# EAGLE design main_full_64 (EAGLE 9.4.2)
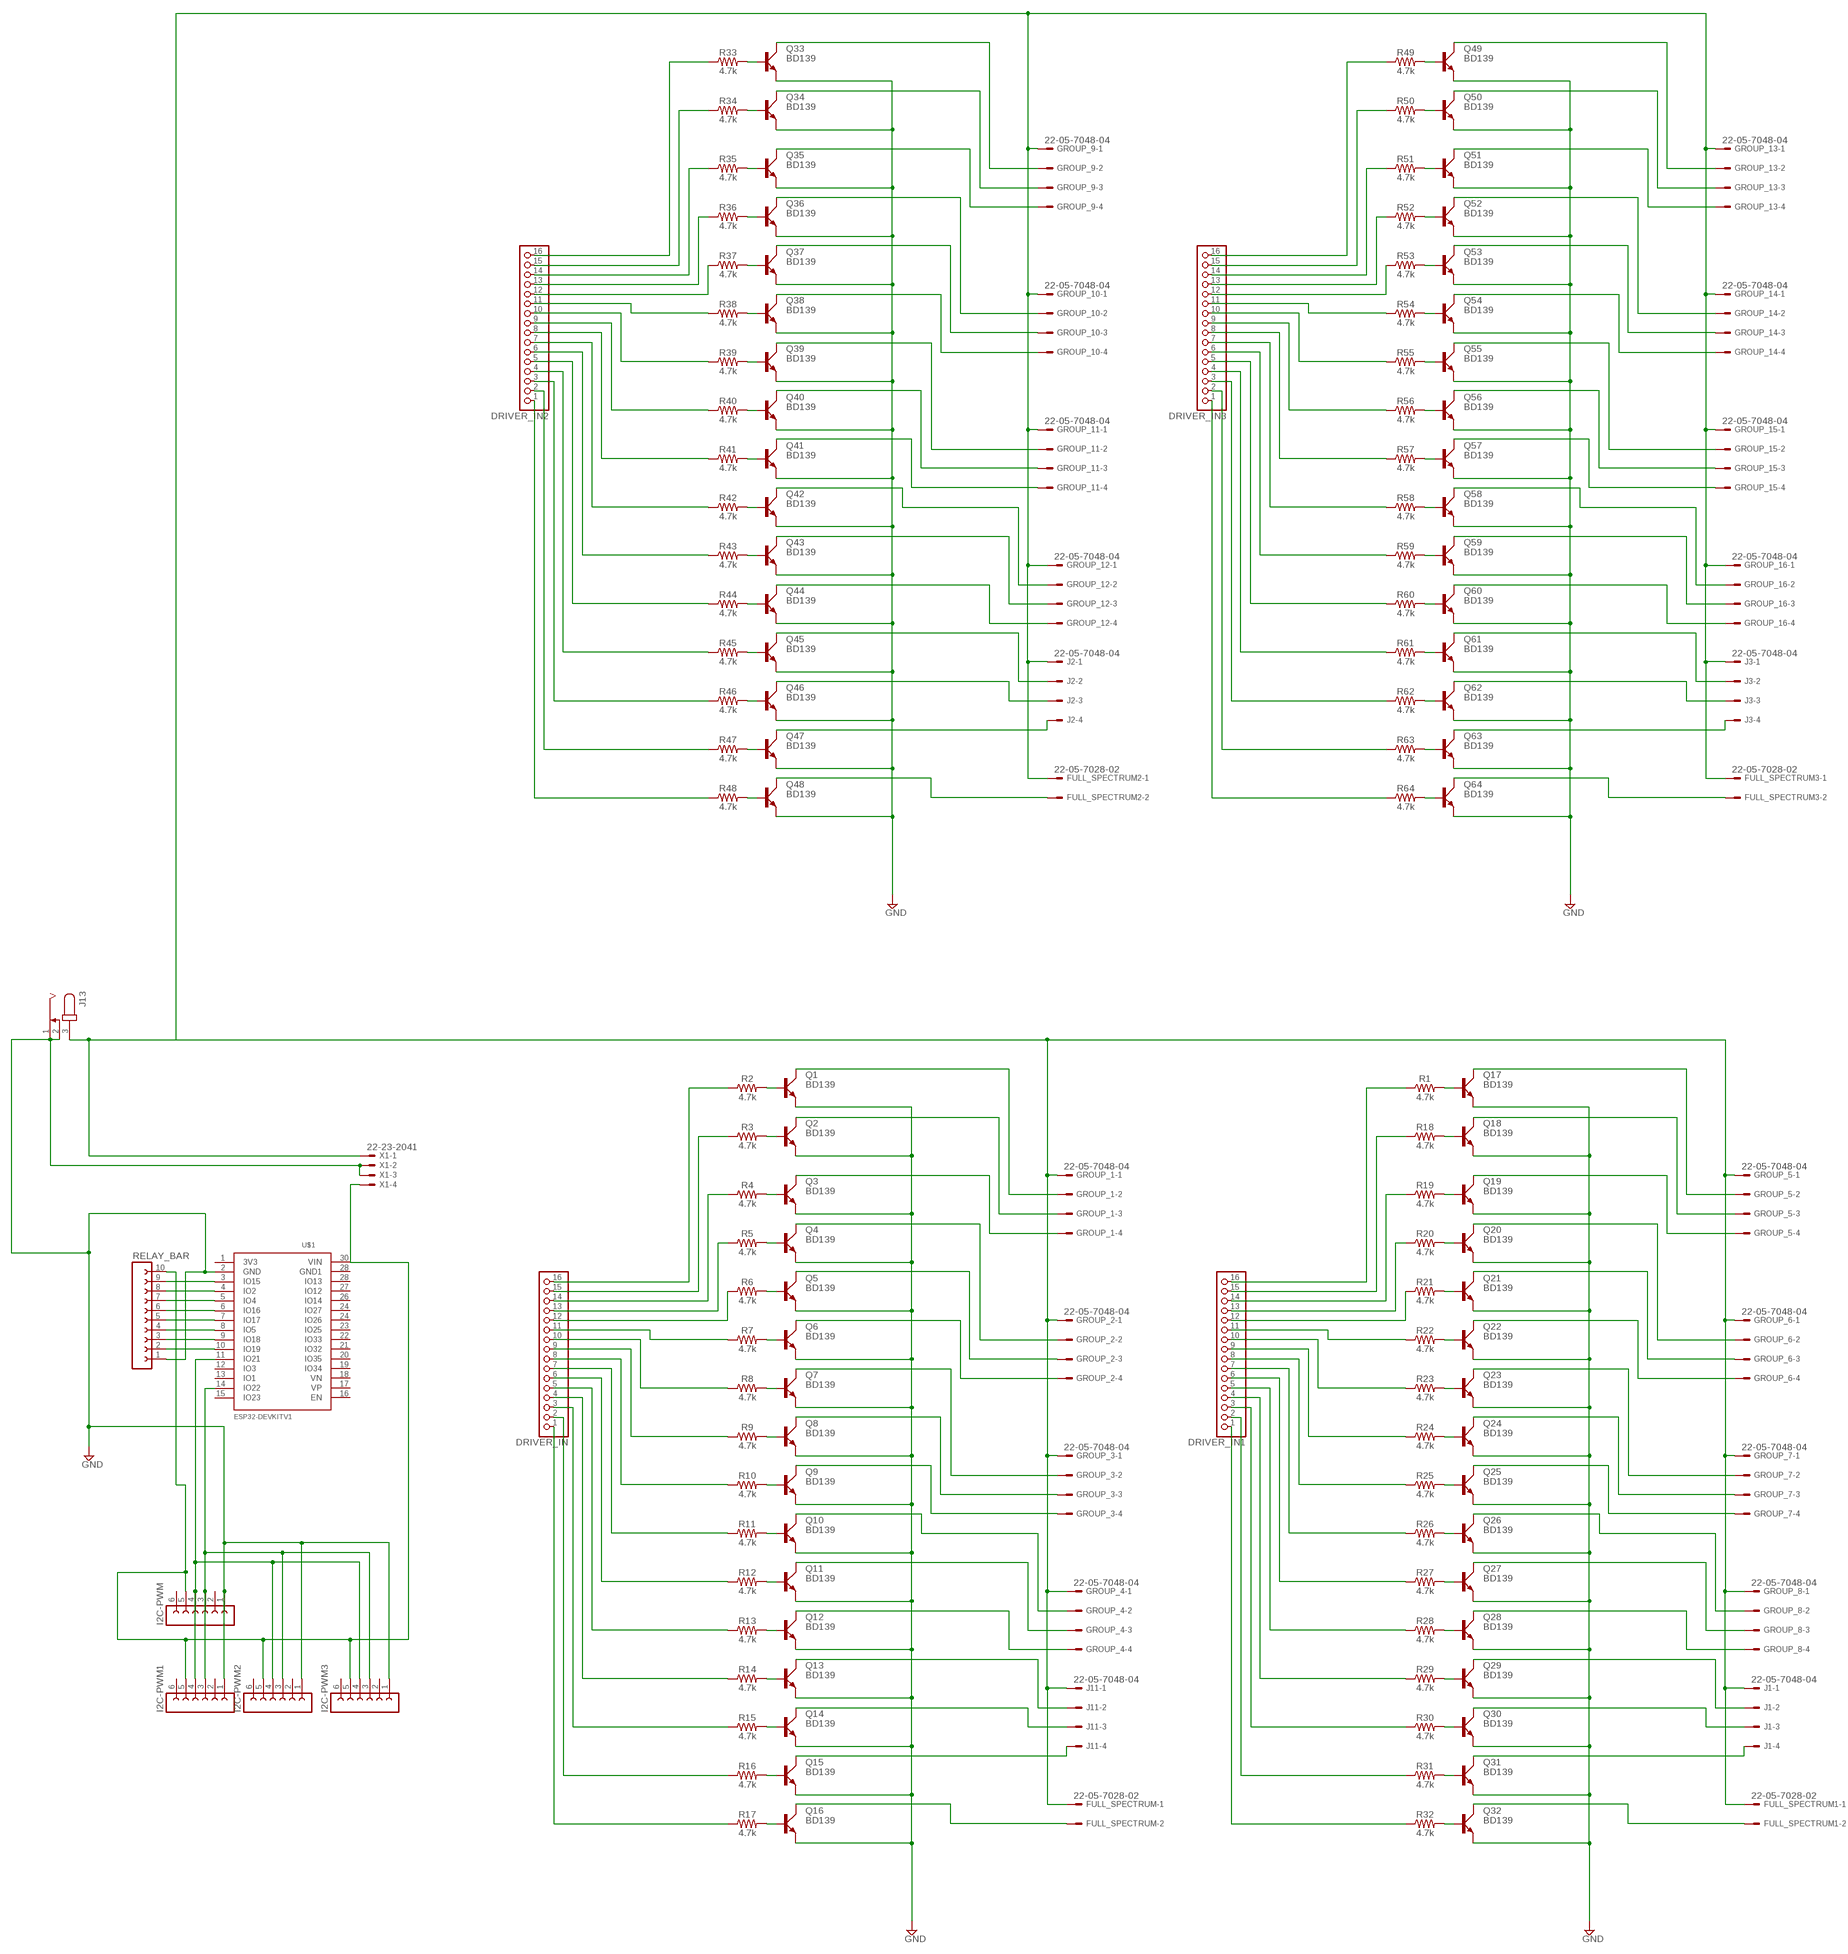
[diagram p0: schematic, sheet 1]

## Parts
DRIVER_IN  PINHD-1X16/90  [1X16/90]
DRIVER_IN1  PINHD-1X16/90  [1X16/90]
DRIVER_IN2  PINHD-1X16/90  [1X16/90]
DRIVER_IN3  PINHD-1X16/90  [1X16/90]
FULL_SPECTRUM  22-05-7028-02  [7395-02]
FULL_SPECTRUM1  22-05-7028-02  [7395-02]
FULL_SPECTRUM2  22-05-7028-02  [7395-02]
FULL_SPECTRUM3  22-05-7028-02  [7395-02]
GROUP_1  22-05-7048-04  [7395-04]
GROUP_2  22-05-7048-04  [7395-04]
GROUP_3  22-05-7048-04  [7395-04]
GROUP_4  22-05-7048-04  [7395-04]
GROUP_5  22-05-7048-04  [7395-04]
GROUP_6  22-05-7048-04  [7395-04]
GROUP_7  22-05-7048-04  [7395-04]
GROUP_8  22-05-7048-04  [7395-04]
GROUP_9  22-05-7048-04  [7395-04]
GROUP_10  22-05-7048-04  [7395-04]
GROUP_11  22-05-7048-04  [7395-04]
GROUP_12  22-05-7048-04  [7395-04]
GROUP_13  22-05-7048-04  [7395-04]
GROUP_14  22-05-7048-04  [7395-04]
GROUP_15  22-05-7048-04  [7395-04]
GROUP_16  22-05-7048-04  [7395-04]
I2C-PWM  FE06W  [FE06W]
I2C-PWM1  FE06W  [FE06W]
I2C-PWM2  FE06W  [FE06W]
I2C-PWM3  FE06W  [FE06W]
J1  22-05-7048-04  [7395-04]
J2  22-05-7048-04  [7395-04]
J3  22-05-7048-04  [7395-04]
J11  22-05-7048-04  [7395-04]
J13  JACK-PLUG0  [SPC4077]
Q1  BD139  [TO126AV]
Q2  BD139  [TO126AV]
Q3  BD139  [TO126AV]
Q4  BD139  [TO126AV]
Q5  BD139  [TO126AV]
Q6  BD139  [TO126AV]
Q7  BD139  [TO126AV]
Q8  BD139  [TO126AV]
Q9  BD139  [TO126AV]
Q10  BD139  [TO126AV]
Q11  BD139  [TO126AV]
Q12  BD139  [TO126AV]
Q13  BD139  [TO126AV]
Q14  BD139  [TO126AV]
Q15  BD139  [TO126AV]
Q16  BD139  [TO126AV]
Q17  BD139  [TO126AV]
Q18  BD139  [TO126AV]
Q19  BD139  [TO126AV]
Q20  BD139  [TO126AV]
Q21  BD139  [TO126AV]
Q22  BD139  [TO126AV]
Q23  BD139  [TO126AV]
Q24  BD139  [TO126AV]
Q25  BD139  [TO126AV]
Q26  BD139  [TO126AV]
Q27  BD139  [TO126AV]
Q28  BD139  [TO126AV]
Q29  BD139  [TO126AV]
Q30  BD139  [TO126AV]
Q31  BD139  [TO126AV]
Q32  BD139  [TO126AV]
Q33  BD139  [TO126AV]
Q34  BD139  [TO126AV]
Q35  BD139  [TO126AV]
Q36  BD139  [TO126AV]
Q37  BD139  [TO126AV]
Q38  BD139  [TO126AV]
Q39  BD139  [TO126AV]
Q40  BD139  [TO126AV]
Q41  BD139  [TO126AV]
Q42  BD139  [TO126AV]
Q43  BD139  [TO126AV]
Q44  BD139  [TO126AV]
Q45  BD139  [TO126AV]
Q46  BD139  [TO126AV]
Q47  BD139  [TO126AV]
Q48  BD139  [TO126AV]
Q49  BD139  [TO126AV]
Q50  BD139  [TO126AV]
Q51  BD139  [TO126AV]
Q52  BD139  [TO126AV]
Q53  BD139  [TO126AV]
Q54  BD139  [TO126AV]
Q55  BD139  [TO126AV]
Q56  BD139  [TO126AV]
Q57  BD139  [TO126AV]
Q58  BD139  [TO126AV]
Q59  BD139  [TO126AV]
Q60  BD139  [TO126AV]
Q61  BD139  [TO126AV]
Q62  BD139  [TO126AV]
Q63  BD139  [TO126AV]
Q64  BD139  [TO126AV]
R1  4.7k  4.7KOHM-0603-1/10W-1%  [0603]
R2  4.7k  4.7KOHM-0603-1/10W-1%  [0603]
R3  4.7k  4.7KOHM-0603-1/10W-1%  [0603]
R4  4.7k  4.7KOHM-0603-1/10W-1%  [0603]
R5  4.7k  4.7KOHM-0603-1/10W-1%  [0603]
R6  4.7k  4.7KOHM-0603-1/10W-1%  [0603]
R7  4.7k  4.7KOHM-0603-1/10W-1%  [0603]
R8  4.7k  4.7KOHM-0603-1/10W-1%  [0603]
R9  4.7k  4.7KOHM-0603-1/10W-1%  [0603]
R10  4.7k  4.7KOHM-0603-1/10W-1%  [0603]
R11  4.7k  4.7KOHM-0603-1/10W-1%  [0603]
R12  4.7k  4.7KOHM-0603-1/10W-1%  [0603]
R13  4.7k  4.7KOHM-0603-1/10W-1%  [0603]
R14  4.7k  4.7KOHM-0603-1/10W-1%  [0603]
R15  4.7k  4.7KOHM-0603-1/10W-1%  [0603]
R16  4.7k  4.7KOHM-0603-1/10W-1%  [0603]
R17  4.7k  4.7KOHM-0603-1/10W-1%  [0603]
R18  4.7k  4.7KOHM-0603-1/10W-1%  [0603]
R19  4.7k  4.7KOHM-0603-1/10W-1%  [0603]
R20  4.7k  4.7KOHM-0603-1/10W-1%  [0603]
R21  4.7k  4.7KOHM-0603-1/10W-1%  [0603]
R22  4.7k  4.7KOHM-0603-1/10W-1%  [0603]
R23  4.7k  4.7KOHM-0603-1/10W-1%  [0603]
R24  4.7k  4.7KOHM-0603-1/10W-1%  [0603]
R25  4.7k  4.7KOHM-0603-1/10W-1%  [0603]
R26  4.7k  4.7KOHM-0603-1/10W-1%  [0603]
R27  4.7k  4.7KOHM-0603-1/10W-1%  [0603]
R28  4.7k  4.7KOHM-0603-1/10W-1%  [0603]
R29  4.7k  4.7KOHM-0603-1/10W-1%  [0603]
R30  4.7k  4.7KOHM-0603-1/10W-1%  [0603]
R31  4.7k  4.7KOHM-0603-1/10W-1%  [0603]
R32  4.7k  4.7KOHM-0603-1/10W-1%  [0603]
R33  4.7k  4.7KOHM-0603-1/10W-1%  [0603]
R34  4.7k  4.7KOHM-0603-1/10W-1%  [0603]
R35  4.7k  4.7KOHM-0603-1/10W-1%  [0603]
R36  4.7k  4.7KOHM-0603-1/10W-1%  [0603]
R37  4.7k  4.7KOHM-0603-1/10W-1%  [0603]
R38  4.7k  4.7KOHM-0603-1/10W-1%  [0603]
R39  4.7k  4.7KOHM-0603-1/10W-1%  [0603]
R40  4.7k  4.7KOHM-0603-1/10W-1%  [0603]
R41  4.7k  4.7KOHM-0603-1/10W-1%  [0603]
R42  4.7k  4.7KOHM-0603-1/10W-1%  [0603]
R43  4.7k  4.7KOHM-0603-1/10W-1%  [0603]
R44  4.7k  4.7KOHM-0603-1/10W-1%  [0603]
R45  4.7k  4.7KOHM-0603-1/10W-1%  [0603]
R46  4.7k  4.7KOHM-0603-1/10W-1%  [0603]
R47  4.7k  4.7KOHM-0603-1/10W-1%  [0603]
R48  4.7k  4.7KOHM-0603-1/10W-1%  [0603]
R49  4.7k  4.7KOHM-0603-1/10W-1%  [0603]
R50  4.7k  4.7KOHM-0603-1/10W-1%  [0603]
R51  4.7k  4.7KOHM-0603-1/10W-1%  [0603]
R52  4.7k  4.7KOHM-0603-1/10W-1%  [0603]
R53  4.7k  4.7KOHM-0603-1/10W-1%  [0603]
R54  4.7k  4.7KOHM-0603-1/10W-1%  [0603]
R55  4.7k  4.7KOHM-0603-1/10W-1%  [0603]
R56  4.7k  4.7KOHM-0603-1/10W-1%  [0603]
R57  4.7k  4.7KOHM-0603-1/10W-1%  [0603]
R58  4.7k  4.7KOHM-0603-1/10W-1%  [0603]
R59  4.7k  4.7KOHM-0603-1/10W-1%  [0603]
R60  4.7k  4.7KOHM-0603-1/10W-1%  [0603]
R61  4.7k  4.7KOHM-0603-1/10W-1%  [0603]
R62  4.7k  4.7KOHM-0603-1/10W-1%  [0603]
R63  4.7k  4.7KOHM-0603-1/10W-1%  [0603]
R64  4.7k  4.7KOHM-0603-1/10W-1%  [0603]
RELAY_BAR  FE10W  [FE10W]
U$1  ESP32DEVKITV1  [ESP32-DEVKITV1]
X1  22-23-2041  [22-23-2041]

## Nets
GND: I2C-PWM1.1 I2C-PWM2.1 I2C-PWM3.1 I2C-PWM.1 J13.1 J13.2 Q1.E Q2.E Q3.E Q4.E Q5.E Q6.E Q7.E Q8.E Q9.E Q10.E Q11.E Q12.E Q13.E Q14.E Q15.E Q16.E Q17.E Q18.E Q19.E Q20.E Q21.E Q22.E Q23.E Q24.E Q25.E Q26.E Q27.E Q28.E Q29.E Q30.E Q31.E Q32.E Q33.E Q34.E Q35.E Q36.E Q37.E Q38.E Q39.E Q40.E Q41.E Q42.E Q43.E Q44.E Q45.E Q46.E Q47.E Q48.E Q49.E Q50.E Q51.E Q52.E Q53.E Q54.E Q55.E Q56.E Q57.E Q58.E Q59.E Q60.E Q61.E Q62.E Q63.E Q64.E RELAY_BAR.1 U$1.2(GND) X1.2 X1.3
N$1: FULL_SPECTRUM1.1 FULL_SPECTRUM2.1 FULL_SPECTRUM3.1 FULL_SPECTRUM.1 GROUP_1.1 GROUP_2.1 GROUP_3.1 GROUP_4.1 GROUP_5.1 GROUP_6.1 GROUP_7.1 GROUP_8.1 GROUP_9.1 GROUP_10.1 GROUP_11.1 GROUP_12.1 GROUP_13.1 GROUP_14.1 GROUP_15.1 GROUP_16.1 J1.1 J2.1 J3.1 J11.1 J13.3 X1.1
N$3: Q1.B R2.2
N$4: Q2.B R3.2
N$5: Q3.B R4.2
N$6: Q4.B R5.2
N$7: Q5.B R6.2
N$8: Q6.B R7.2
N$9: Q7.B R8.2
N$10: Q8.B R9.2
N$11: Q9.B R10.2
N$12: Q10.B R11.2
N$13: Q11.B R12.2
N$14: Q12.B R13.2
N$15: Q13.B R14.2
N$16: Q14.B R15.2
N$17: Q15.B R16.2
N$18: Q16.B R17.2
N$19: DRIVER_IN.1 R17.1
N$20: DRIVER_IN.2 R16.1
N$21: DRIVER_IN.3 R15.1
N$22: DRIVER_IN.4 R14.1
N$23: DRIVER_IN.5 R13.1
N$24: DRIVER_IN.6 R12.1
N$25: DRIVER_IN.7 R11.1
N$26: DRIVER_IN.8 R10.1
N$27: DRIVER_IN.9 R9.1
N$28: DRIVER_IN.10 R8.1
N$29: DRIVER_IN.11 R7.1
N$30: DRIVER_IN.12 R6.1
N$31: DRIVER_IN.13 R5.1
N$32: DRIVER_IN.14 R4.1
N$33: DRIVER_IN.15 R3.1
N$34: DRIVER_IN.16 R2.1
N$35: RELAY_BAR.9 U$1.3(IO15)
N$36: RELAY_BAR.8 U$1.4(IO2)
N$37: RELAY_BAR.7 U$1.5(IO4)
N$38: RELAY_BAR.6 U$1.6(IO16)
N$39: RELAY_BAR.5 U$1.7(IO17)
N$40: RELAY_BAR.4 U$1.8(IO5)
N$41: RELAY_BAR.3 U$1.9(IO18)
N$42: RELAY_BAR.2 U$1.10(IO19)
N$44: Q17.B R1.2
N$45: Q18.B R18.2
N$46: Q19.B R19.2
N$47: Q20.B R20.2
N$48: Q21.B R21.2
N$51: GROUP_1.2 Q1.C
N$52: GROUP_1.3 Q2.C
N$53: GROUP_1.4 Q3.C
N$54: GROUP_2.2 Q4.C
N$55: GROUP_2.3 Q5.C
N$56: GROUP_2.4 Q6.C
N$57: GROUP_3.2 Q7.C
N$58: GROUP_3.3 Q8.C
N$59: GROUP_3.4 Q9.C
N$60: GROUP_4.2 Q10.C
N$61: GROUP_4.3 Q11.C
N$62: GROUP_4.4 Q12.C
N$63: Q22.B R22.2
N$64: J11.2 Q13.C
N$65: J11.3 Q14.C
N$66: J11.4 Q15.C
N$67: FULL_SPECTRUM.2 Q16.C
N$68: Q23.B R23.2
N$69: Q24.B R24.2
N$70: Q25.B R25.2
N$71: Q26.B R26.2
N$72: Q27.B R27.2
N$73: Q28.B R28.2
N$74: Q29.B R29.2
N$75: Q30.B R30.2
N$76: Q31.B R31.2
N$77: Q32.B R32.2
N$78: DRIVER_IN1.1 R32.1
N$79: DRIVER_IN1.2 R31.1
N$80: DRIVER_IN1.3 R30.1
N$81: DRIVER_IN1.4 R29.1
N$82: DRIVER_IN1.5 R28.1
N$83: DRIVER_IN1.6 R27.1
N$84: DRIVER_IN1.7 R26.1
N$85: DRIVER_IN1.8 R25.1
N$86: DRIVER_IN1.9 R24.1
N$87: DRIVER_IN1.10 R23.1
N$88: DRIVER_IN1.11 R22.1
N$89: DRIVER_IN1.12 R21.1
N$90: DRIVER_IN1.13 R20.1
N$91: DRIVER_IN1.14 R19.1
N$92: DRIVER_IN1.15 R18.1
N$93: DRIVER_IN1.16 R1.1
N$94: GROUP_5.2 Q17.C
N$95: GROUP_5.3 Q18.C
N$96: GROUP_5.4 Q19.C
N$97: GROUP_6.2 Q20.C
N$98: GROUP_6.3 Q21.C
N$99: GROUP_6.4 Q22.C
N$100: GROUP_7.2 Q23.C
N$101: GROUP_7.3 Q24.C
N$102: GROUP_7.4 Q25.C
N$103: GROUP_8.2 Q26.C
N$104: GROUP_8.3 Q27.C
N$105: GROUP_8.4 Q28.C
N$106: J1.2 Q29.C
N$107: J1.3 Q30.C
N$108: J1.4 Q31.C
N$109: FULL_SPECTRUM1.2 Q32.C
N$110: Q33.B R33.2
N$111: Q34.B R34.2
N$112: Q35.B R35.2
N$113: Q36.B R36.2
N$114: Q37.B R37.2
N$115: Q38.B R38.2
N$116: Q39.B R39.2
N$117: Q40.B R40.2
N$118: Q41.B R41.2
N$119: Q42.B R42.2
N$120: Q43.B R43.2
N$121: Q44.B R44.2
N$122: Q45.B R45.2
N$123: Q46.B R46.2
N$124: Q47.B R47.2
N$125: Q48.B R48.2
N$126: DRIVER_IN2.1 R48.1
N$127: DRIVER_IN2.2 R47.1
N$128: DRIVER_IN2.3 R46.1
N$129: DRIVER_IN2.4 R45.1
N$130: DRIVER_IN2.5 R44.1
N$131: DRIVER_IN2.6 R43.1
N$132: DRIVER_IN2.7 R42.1
N$133: DRIVER_IN2.8 R41.1
N$134: DRIVER_IN2.9 R40.1
N$135: DRIVER_IN2.10 R39.1
N$136: DRIVER_IN2.11 R38.1
N$137: DRIVER_IN2.12 R37.1
N$138: DRIVER_IN2.13 R36.1
N$139: DRIVER_IN2.14 R35.1
N$140: DRIVER_IN2.15 R34.1
N$141: DRIVER_IN2.16 R33.1
N$142: GROUP_9.2 Q33.C
N$143: GROUP_9.3 Q34.C
N$144: GROUP_9.4 Q35.C
N$145: GROUP_10.2 Q36.C
N$146: GROUP_10.3 Q37.C
N$147: GROUP_10.4 Q38.C
N$148: GROUP_11.2 Q39.C
N$149: GROUP_11.3 Q40.C
N$150: GROUP_11.4 Q41.C
N$151: GROUP_12.2 Q42.C
N$152: GROUP_12.3 Q43.C
N$153: GROUP_12.4 Q44.C
N$154: J2.2 Q45.C
N$155: J2.3 Q46.C
N$156: J2.4 Q47.C
N$157: FULL_SPECTRUM2.2 Q48.C
N$158: Q49.B R49.2
N$159: Q50.B R50.2
N$160: Q51.B R51.2
N$161: Q52.B R52.2
N$162: Q53.B R53.2
N$163: Q54.B R54.2
N$164: Q55.B R55.2
N$165: Q56.B R56.2
N$166: Q57.B R57.2
N$167: Q58.B R58.2
N$168: Q59.B R59.2
N$169: Q60.B R60.2
N$170: Q61.B R61.2
N$171: Q62.B R62.2
N$172: Q63.B R63.2
N$173: Q64.B R64.2
N$174: DRIVER_IN3.1 R64.1
N$175: DRIVER_IN3.2 R63.1
N$176: DRIVER_IN3.3 R62.1
N$177: DRIVER_IN3.4 R61.1
N$178: DRIVER_IN3.5 R60.1
N$179: DRIVER_IN3.6 R59.1
N$180: DRIVER_IN3.7 R58.1
N$181: DRIVER_IN3.8 R57.1
N$182: DRIVER_IN3.9 R56.1
N$183: DRIVER_IN3.10 R55.1
N$184: DRIVER_IN3.11 R54.1
N$185: DRIVER_IN3.12 R53.1
N$186: DRIVER_IN3.13 R52.1
N$187: DRIVER_IN3.14 R51.1
N$188: DRIVER_IN3.15 R50.1
N$189: DRIVER_IN3.16 R49.1
N$190: GROUP_13.2 Q49.C
N$191: GROUP_13.3 Q50.C
N$192: GROUP_13.4 Q51.C
N$193: GROUP_14.2 Q52.C
N$194: GROUP_14.3 Q53.C
N$195: GROUP_14.4 Q54.C
N$196: GROUP_15.2 Q55.C
N$197: GROUP_15.3 Q56.C
N$198: GROUP_15.4 Q57.C
N$199: GROUP_16.2 Q58.C
N$200: GROUP_16.3 Q59.C
N$201: GROUP_16.4 Q60.C
N$202: J3.2 Q61.C
N$203: J3.3 Q62.C
N$204: J3.4 Q63.C
N$205: FULL_SPECTRUM3.2 Q64.C
N$208: I2C-PWM1.4 I2C-PWM2.4 I2C-PWM3.4 I2C-PWM.4 U$1.11(IO21)
N$209: I2C-PWM1.3 I2C-PWM2.3 I2C-PWM3.3 I2C-PWM.3 U$1.14(IO22)
N$210: I2C-PWM1.5 I2C-PWM2.5 I2C-PWM3.5 I2C-PWM.5 RELAY_BAR.10 U$1.30(VIN) X1.4
Unconnected: I2C-PWM1.2 I2C-PWM1.6 I2C-PWM2.2 I2C-PWM2.6 I2C-PWM3.2 I2C-PWM3.6 I2C-PWM.2 I2C-PWM.6 U$1.1(3V3) U$1.12(IO3) U$1.13(IO1) U$1.15(IO23) U$1.16(EN) U$1.17(VP) U$1.18(VN) U$1.19(IO34) U$1.20(IO35) U$1.21(IO32) U$1.22(IO33) U$1.23(IO25) U$1.24(IO26) U$1.24(IO27) U$1.26(IO14) U$1.27(IO12) U$1.28(GND1) U$1.28(IO13)

## Library data of the parts
DRIVER_IN DRIVER_IN1-DRIVER_IN3 = pinhead:PINHD-1X16: PIN HEADER
FULL_SPECTRUM FULL_SPECTRUM1-FULL_SPECTRUM3 = con-molex:22-?-02: CONNECTOR wire to board 2.54 mm (.1 inch) pitch header; MF: MOLEX; OC_FARNELL: 9731601; OC_NEWARK: unknown
GROUP_1-GROUP_16 J1-J3 J11 = con-molex:22-?-04: CONNECTOR wire to board 2.54 mm (.1 inch) pitch header; MF: MOLEX; OC_FARNELL: unknown; OC_NEWARK: unknown
I2C-PWM I2C-PWM1-I2C-PWM3 = con-lsta:FE06W: FEMALE HEADER; OC_FARNELL: unknown; OC_NEWARK: unknown
J13 = con-jack:JACK-PLUG: DC POWER JACK Power Jack, DC, Right Angle, Through Hole, Rated 5A at 16VDC, PC Terminals Distributor: Farnell (www.Farnell.de) Drawing: 84N1161.pdf / 84N1162.pdf Manufacturer: SPC Technology (www.spctechnology.com) Type: SPC4077 / SPC 4078; OC_FARNELL: unknown; OC_NEWARK: unknown
Q1-Q64 = transistor-power:BD139: NPN TRANSISTOR
R1-R64 = SparkFun-Resistors:4.7KOHM: 4.7kΩ resistor A resistor is a passive two-terminal electrical component that implements electrical resistance as a circuit element. Resistors act to reduce current flow, and, at the same time, act to lower voltage levels within circuits. - Wikipedia; PROD_ID: RES-07857
RELAY_BAR = con-lsta:FE10W: FEMALE HEADER; OC_FARNELL: unknown; OC_NEWARK: unknown
U$1 = ESP32-DEVKITV1:ESP32DEVKITV1
X1 = con-molex:22-23-2041: .100" (2.54mm) Center Header - 4 Pin; MF: MOLEX; MPN: 22-23-2041; OC_FARNELL: 1462920; OC_NEWARK: 38C0355

## Board
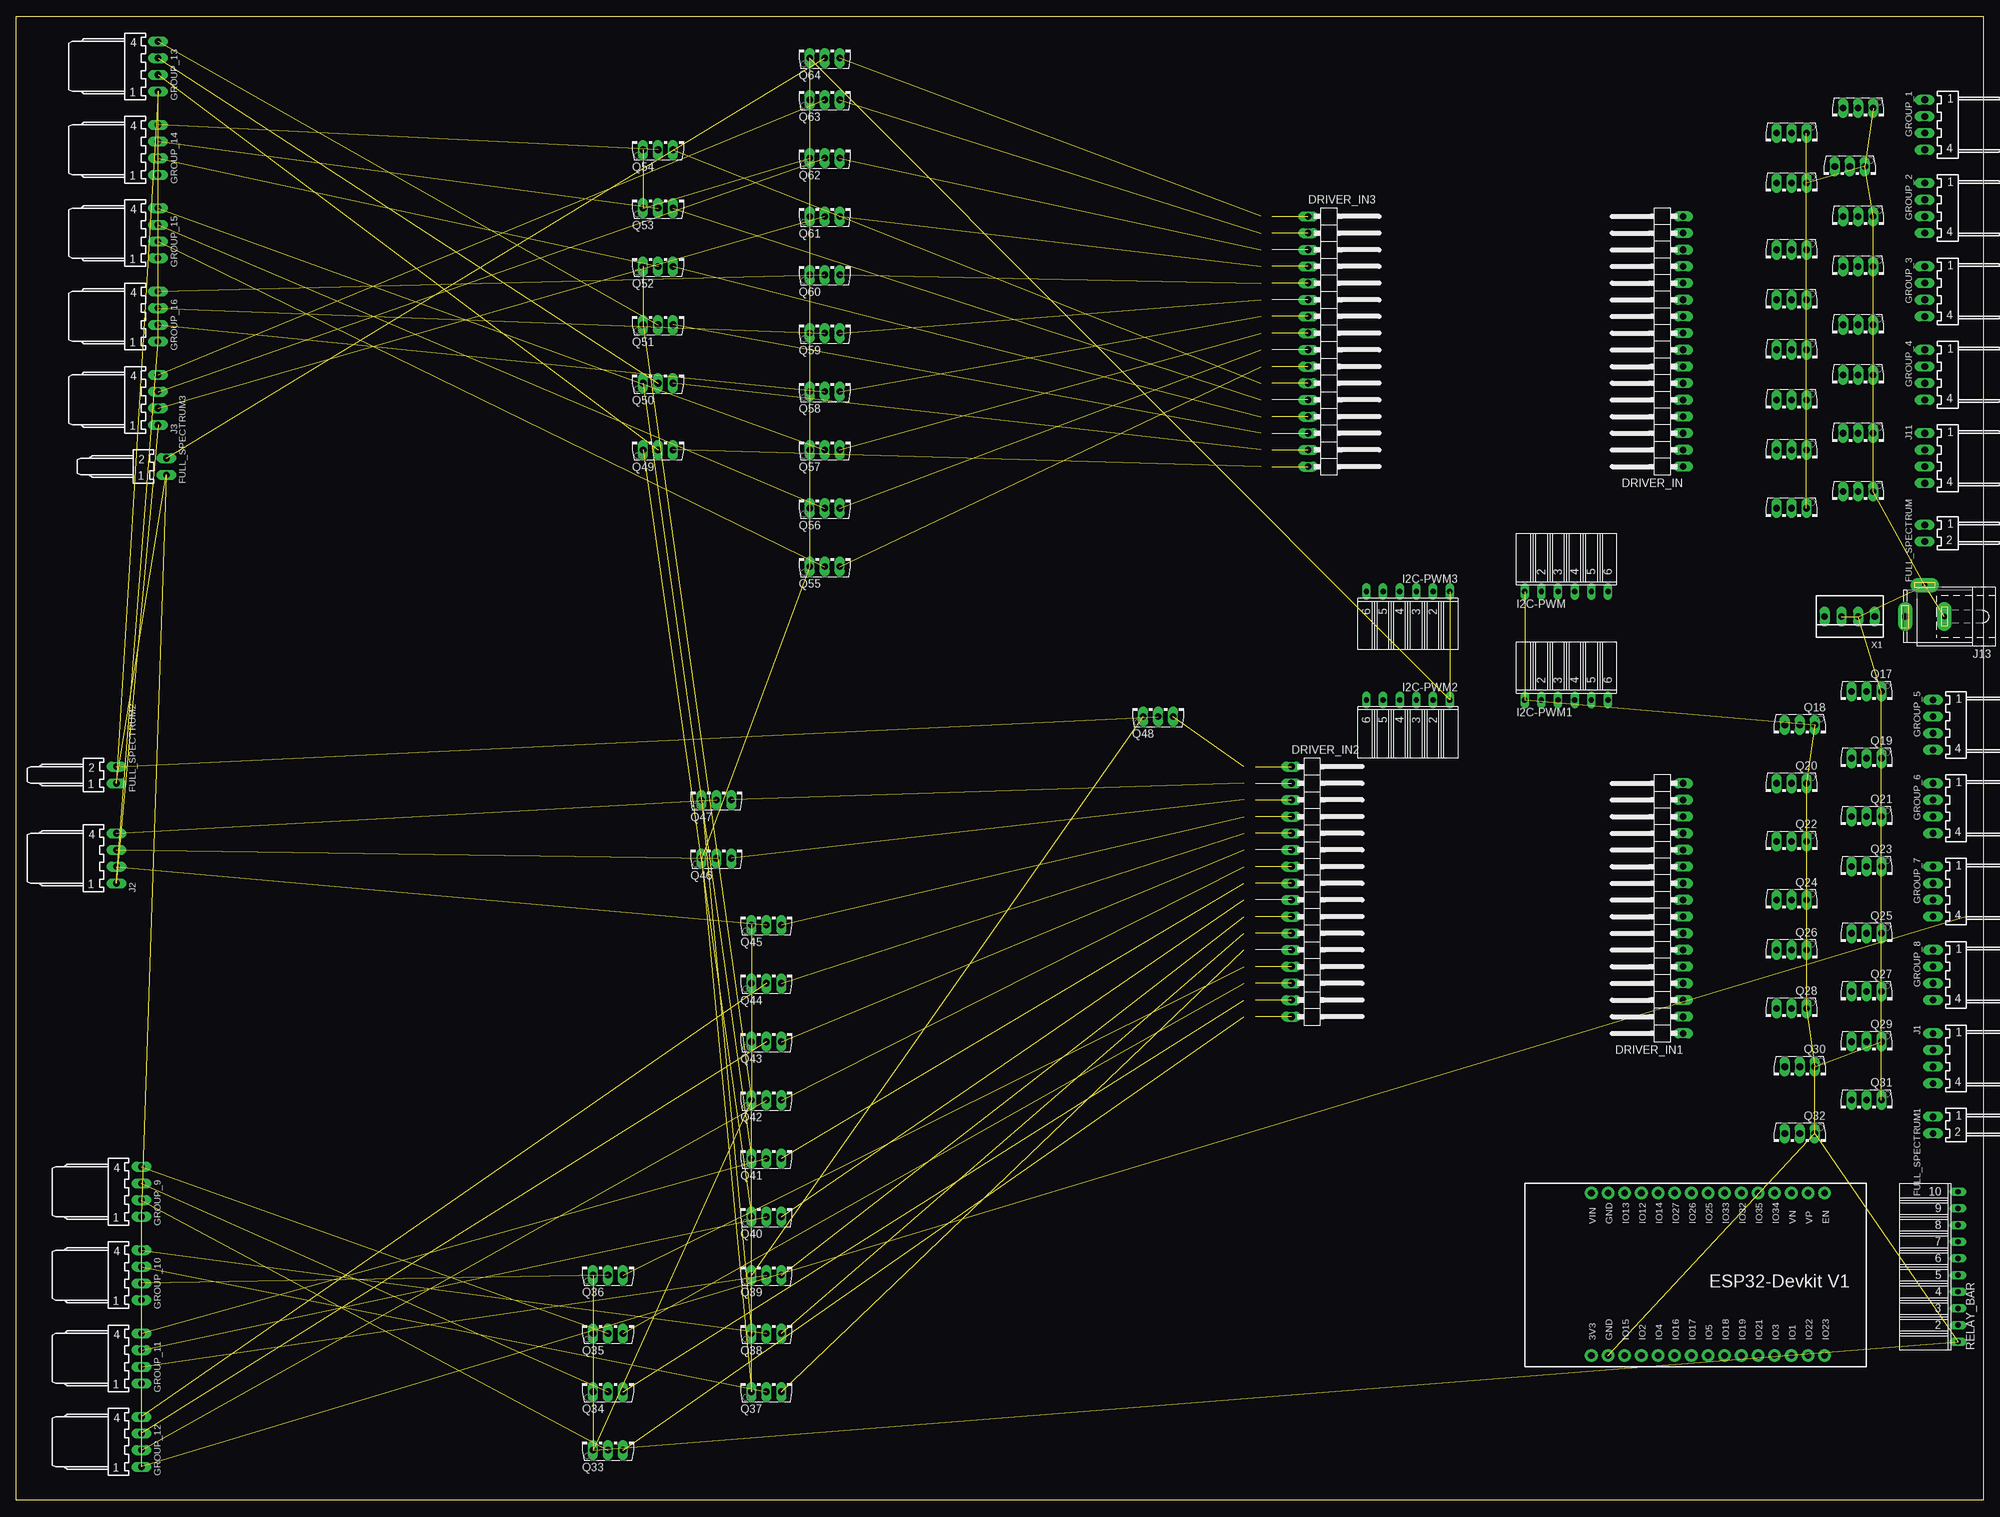
[diagram p1: board, top side]
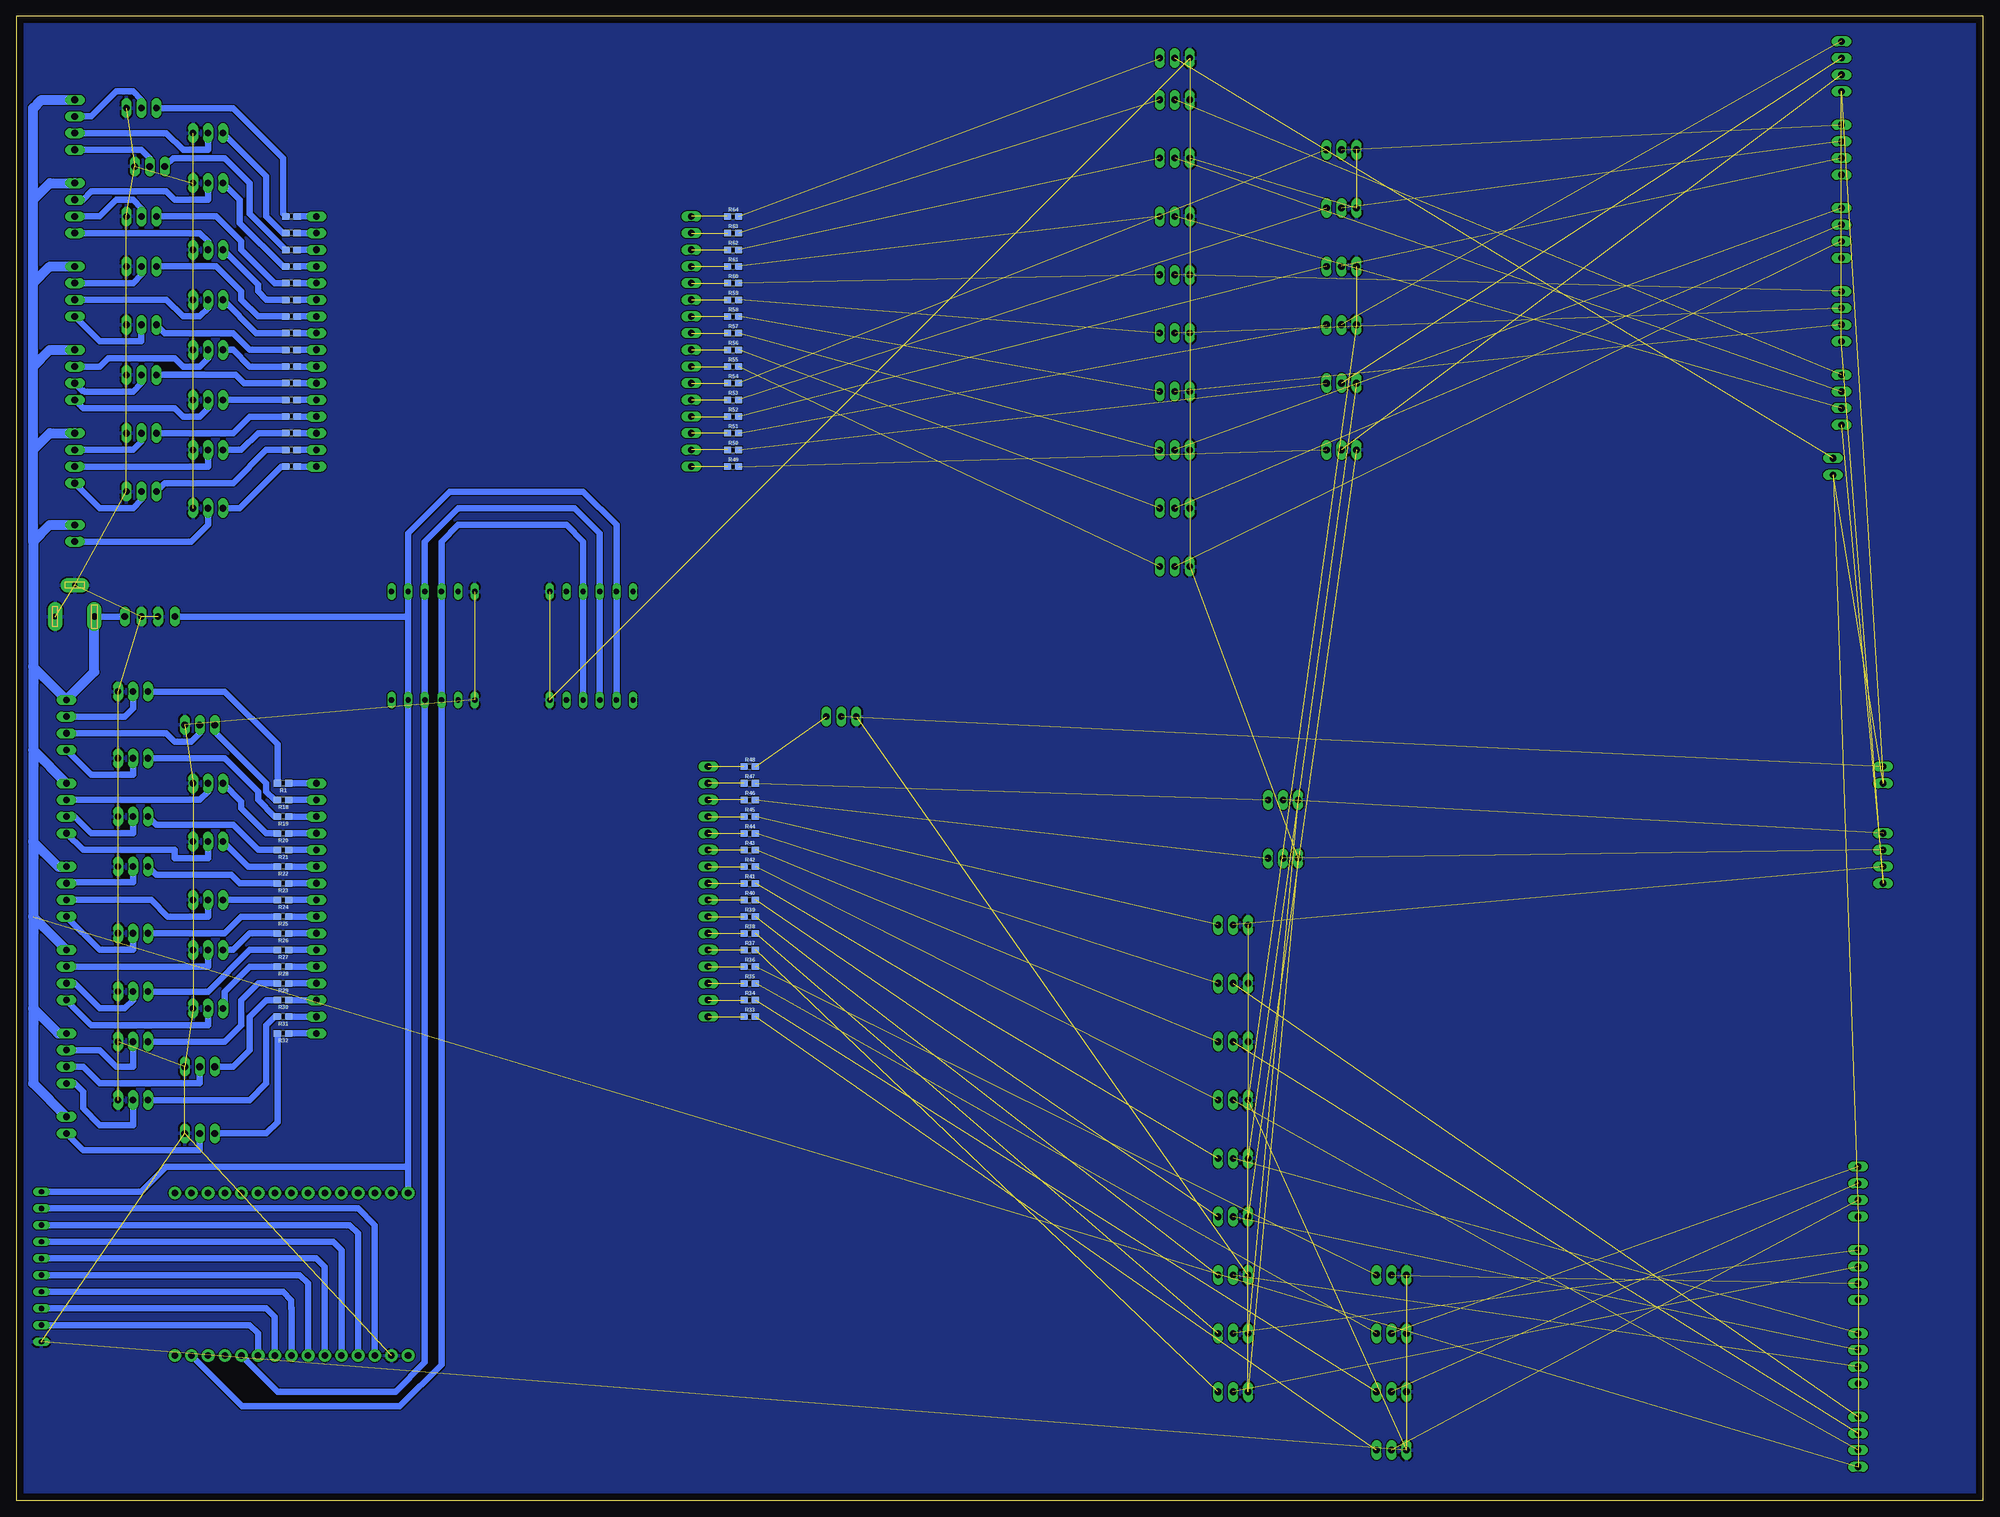
[diagram p2: board, bottom side, seen from below]

Size 299.72 x 226.06 mm. Coordinates in mm from the lower left corner, seen from the top.
Outline: 0,0 0,226.06 299.72,226.06 299.72,0 0,0
Copper layers (1*16): Top 0.035mm / dielectric 1.5mm / Bottom 0.035mm
Design rules "default": minimum track width 6mil, minimum drill 0.35mm, track to track 6mil, track to pad 6mil, pad to pad 6mil, via to via 6mil, smd to smd 6mil, copper to edge 40mil, drill to drill 6mil, minimum pad ring 10mil, minimum via ring 8mil, stop-mask expansion 4mil, vias tented up to drill 0mil, thermal gap 10mil

### Footprints (pad centres in the part's own frame; a part is rotated, then mirrored left to right if it is on the bottom)
1X16/90 = drill 1.016 long: 1 -19.05,-3.81; 2 -16.51,-3.81; 3 -13.97,-3.81; 4 -11.43,-3.81; 5 -8.89,-3.81; 6 -6.35,-3.81; 7 -3.81,-3.81; 8 -1.27,-3.81; 9 1.27,-3.81; 10 3.81,-3.81; 11 6.35,-3.81; 12 8.89,-3.81; 13 11.43,-3.81; 14 13.97,-3.81; 15 16.51,-3.81; 16 19.05,-3.81
7395-02 = drill 1.016 long: 1 1.27,0; 2 -1.27,0
7395-04 = drill 1.016 long: 1 3.81,0; 2 1.27,0; 3 -1.27,0; 4 -3.81,0
FE06W = drill 0.813 long: 1 -6.35,0; 2 -3.81,0; 3 -1.27,0; 4 1.27,0; 5 3.81,0; 6 6.35,0
SPC4077 = drill 0.8 pad 2.184 long: 1 -3,0; 2 0,-4.8 | drill 1 pad 2.184 long: 3 3,0
TO126AV = drill 1.016 long: B 2.286,-1.27; C 0,-1.27; E -2.286,-1.27
0603 = smd 1.1 x 1: 1 -0.85,0; 2 0.85,0
FE10W = drill 0.813 long: 1 -11.43,0; 2 -8.89,0; 3 -6.35,0; 4 -3.81,0; 5 -1.27,0; 6 1.27,0; 7 3.81,0; 8 6.35,0; 9 8.89,0; 10 11.43,0
ESP32-DEVKITV1 = drill 1 pad 1.93: 1 -22.87,-13.54; 2 -20.33,-13.54; 3 -17.79,-13.54; 4 -15.25,-13.54; 5 -12.71,-13.54; 6 -10.17,-13.54; 7 -7.63,-13.54; 8 -5.09,-13.54; 9 -2.55,-13.54; 10 -0.01,-13.54; 11 2.53,-13.54; 12 5.07,-13.54; 13 7.61,-13.54; 14 10.15,-13.54; 15 12.69,-13.54; 16 12.69,11.23; 17 10.15,11.23; 18 7.61,11.23; 19 5.07,11.23; 20 2.53,11.23; 21 -0.01,11.23; 22 -2.55,11.23; 23 -5.09,11.23; 24 -7.63,11.23; 25 -10.17,11.23; 26 -12.71,11.23; 27 -15.25,11.23; 28 -17.79,11.23; 29 -20.33,11.23; 30 -22.87,11.23
22-23-2041 = drill 1 long: 1 -3.81,0; 2 -1.27,0; 3 1.27,0; 4 3.81,0

### Placement (x,y rotation side)
DRIVER_IN  250.19,176.53 90 top
DRIVER_IN1  250.19,90.17 90 top
DRIVER_IN2  198.12,92.71 270 top
DRIVER_IN3  200.66,176.53 270 top
FULL_SPECTRUM  290.83,147.32 90 top
FULL_SPECTRUM1  292.1,57.15 90 top
FULL_SPECTRUM2  15.24,110.49 270 top
FULL_SPECTRUM3  22.86,157.48 270 top
GROUP_1  290.83,209.55 90 top
GROUP_2  290.83,196.85 90 top
GROUP_3  290.83,184.15 90 top
GROUP_4  290.83,171.45 90 top
GROUP_5  292.1,118.11 90 top
GROUP_6  292.1,105.41 90 top
GROUP_7  292.1,92.71 90 top
GROUP_8  292.1,80.01 90 top
GROUP_9  19.05,46.99 270 top
GROUP_10  19.05,34.29 270 top
GROUP_11  19.05,21.59 270 top
GROUP_12  19.05,8.89 270 top
GROUP_13  21.59,218.44 270 top
GROUP_14  21.59,205.74 270 top
GROUP_15  21.59,193.04 270 top
GROUP_16  21.59,180.34 270 top
I2C-PWM  236.22,138.43 0 top
I2C-PWM1  236.22,121.92 0 top
I2C-PWM2  212.09,121.92 180 top
I2C-PWM3  212.09,138.43 180 top
J1  292.1,67.31 90 top
J2  15.24,97.79 270 top
J3  21.59,167.64 270 top
J11  290.83,158.75 90 top
J13  290.83,134.62 180 top
Q1  280.67,210.82 180 top
Q2  270.51,207.01 180 top
Q3  279.4,201.93 180 top
Q4  270.51,199.39 180 top
Q5  280.67,194.31 180 top
Q6  270.51,189.23 180 top
Q7  280.67,186.69 180 top
Q8  270.51,181.61 180 top
Q9  280.67,177.8 180 top
Q10  270.51,173.99 180 top
Q11  280.67,170.18 180 top
Q12  270.51,166.37 180 top
Q13  280.67,161.29 180 top
Q14  270.51,158.75 180 top
Q15  280.67,152.4 180 top
Q16  270.51,149.86 180 top
Q17  281.94,121.92 180 top
Q18  271.78,116.84 180 top
Q19  281.94,111.76 180 top
Q20  270.51,107.95 180 top
Q21  281.94,102.87 180 top
Q22  270.51,99.06 180 top
Q23  281.94,95.25 180 top
Q24  270.51,90.17 180 top
Q25  281.94,85.09 180 top
Q26  270.51,82.55 180 top
Q27  281.94,76.2 180 top
Q28  270.51,73.66 180 top
Q29  281.94,68.58 180 top
Q30  271.78,64.77 180 top
Q31  281.94,59.69 180 top
Q32  271.78,54.61 180 top
Q33  90.17,8.89 0 top
Q34  90.17,17.78 0 top
Q35  90.17,26.67 0 top
Q36  90.17,35.56 0 top
Q37  114.3,17.78 0 top
Q38  114.3,26.67 0 top
Q39  114.3,35.56 0 top
Q40  114.3,44.45 0 top
Q41  114.3,53.34 0 top
Q42  114.3,62.23 0 top
Q43  114.3,71.12 0 top
Q44  114.3,80.01 0 top
Q45  114.3,88.9 0 top
Q46  106.68,99.06 0 top
Q47  106.68,107.95 0 top
Q48  173.99,120.65 0 top
Q49  97.79,161.29 0 top
Q50  97.79,171.45 0 top
Q51  97.79,180.34 0 top
Q52  97.79,189.23 0 top
Q53  97.79,198.12 0 top
Q54  97.79,207.01 0 top
Q55  123.19,143.51 0 top
Q56  123.19,152.4 0 top
Q57  123.19,161.29 0 top
Q58  123.19,170.18 0 top
Q59  123.19,179.07 0 top
Q60  123.19,187.96 0 top
Q61  123.19,196.85 0 top
Q62  123.19,205.74 0 top
Q63  123.19,214.63 0 top
Q64  123.19,220.98 0 top
R1  259.08,109.22 180 bottom
R2  257.81,195.58 180 bottom
R3  257.81,193.04 180 bottom
R4  257.81,190.5 180 bottom
R5  257.81,187.96 180 bottom
R6  257.81,185.42 180 bottom
R7  257.81,182.88 180 bottom
R8  257.81,180.34 180 bottom
R9  257.81,177.8 180 bottom
R10  257.81,175.26 180 bottom
R11  257.81,172.72 180 bottom
R12  257.81,170.18 180 bottom
R13  257.81,167.64 180 bottom
R14  257.81,165.1 180 bottom
R15  257.81,162.56 180 bottom
R16  257.81,160.02 180 bottom
R17  257.81,157.48 180 bottom
R18  259.08,106.68 180 bottom
R19  259.08,104.14 180 bottom
R20  259.08,101.6 180 bottom
R21  259.08,99.06 180 bottom
R22  259.08,96.52 180 bottom
R23  259.08,93.98 180 bottom
R24  259.08,91.44 180 bottom
R25  259.08,88.9 180 bottom
R26  259.08,86.36 180 bottom
R27  259.08,83.82 180 bottom
R28  259.08,81.28 180 bottom
R29  259.08,78.74 180 bottom
R30  259.08,76.2 180 bottom
R31  259.08,73.66 180 bottom
R32  259.08,71.12 180 bottom
R33  187.96,73.66 0 bottom
R34  187.96,76.2 0 bottom
R35  187.96,78.74 0 bottom
R36  187.96,81.28 0 bottom
R37  187.96,83.82 0 bottom
R38  187.96,86.36 0 bottom
R39  187.96,88.9 0 bottom
R40  187.96,91.44 0 bottom
R41  187.96,93.98 0 bottom
R42  187.96,96.52 0 bottom
R43  187.96,99.06 0 bottom
R44  187.96,101.6 0 bottom
R45  187.96,104.14 0 bottom
R46  187.96,106.68 0 bottom
R47  187.96,109.22 0 bottom
R48  187.96,111.76 0 bottom
R49  190.5,157.48 0 bottom
R50  190.5,160.02 0 bottom
R51  190.5,162.56 0 bottom
R52  190.5,165.1 0 bottom
R53  190.5,167.64 0 bottom
R54  190.5,170.18 0 bottom
R55  190.5,172.72 0 bottom
R56  190.5,175.26 0 bottom
R57  190.5,177.8 0 bottom
R58  190.5,180.34 0 bottom
R59  190.5,182.88 0 bottom
R60  190.5,185.42 0 bottom
R61  190.5,187.96 0 bottom
R62  190.5,190.5 0 bottom
R63  190.5,193.04 0 bottom
R64  190.5,195.58 0 bottom
RELAY_BAR  295.91,35.56 90 top
U$1  262.89,35.56 0 top
X1  279.4,134.62 180 top

### Tracks (layer width: path | path; a pad name or v marks a point on that pad's centre or on a via)
GND  (73 unrouted)
  pour Bottom: 1.27,-1.27 1.27,226.06 299.72,226.06 299.72,-1.27
N$1  (12 unrouted)
  Bottom 1.016: X1.1 J13.3
  Bottom 1.524: 297.18,146.05 297.18,160.02 | 297.18,160.02 297.18,172.72 | 297.18,172.72 297.18,185.42 | 297.18,185.42 297.18,198.12 | 297.18,198.12 297.18,212.09 295.91,213.36 GROUP_1.1 | 297.18,198.12 294.64,200.66 GROUP_2.1 | 297.18,185.42 294.64,187.96 GROUP_3.1 | 297.18,172.72 294.64,175.26 GROUP_4.1 | 297.18,160.02 294.64,162.56 J11.1 | 297.18,146.05 294.64,148.59 FULL_SPECTRUM.1 | 297.18,146.05 297.18,127 | 297.18,127 297.18,114.3 | 297.18,114.3 297.18,100.33 | 297.18,100.33 297.18,88.9 | 297.18,88.9 297.18,74.93 | 297.18,74.93 297.18,63.5 FULL_SPECTRUM1.1 | 297.18,74.93 293.37,71.12 J1.1 | 297.18,88.9 GROUP_8.1 | 297.18,100.33 293.37,96.52 GROUP_7.1 | 297.18,114.3 GROUP_6.1 | 297.18,127 GROUP_5.1 287.83,126.19 J13.3
N$3
  Bottom 1.016: Q1.B 266.7,212.09 259.08,204.47 259.08,196 R2.2
N$4
  Bottom 1.016: Q2.B 261.62,201.68 261.62,195.58 259.08,193.04 R3.2
N$5
  Bottom 1.016: Q3.B 275.84,204.47 267.97,204.47 264.16,200.66 264.16,196 R4.2
N$6
  Bottom 1.016: Q4.B 265.68,198.12 265.68,194.56 259.08,187.96 R5.2
N$7
  Bottom 1.016: Q5.B 269.24,195.58 265.43,191.77 265.43,190.5 260.35,185.42 R6.2
N$8
  Bottom 1.016: Q6.B 262.89,185.17 262.89,184.15 261.62,182.88 R7.2
N$9
  Bottom 1.016: R8.2 262.89,180.34 265.43,182.88 265.43,184.15 269.24,187.96 Q7.B
N$10
  Bottom 1.016: Q8.B 263.14,177.8 R9.2
N$11
  Bottom 1.016: R10.2 264.16,175.26 266.7,177.8 277.11,177.8 Q9.B
N$12
  Bottom 1.016: Q10.B 266.7,175.26 264.16,172.72 R11.2
N$13
  Bottom 1.016: R12.2 265.01,170.18 266.28,171.45 Q11.B
N$14
  Bottom 1.016: Q12.B R13.2
N$15
  Bottom 1.016: Q13.B 266.7,162.56 264.16,165.1 R14.2
N$16
  Bottom 1.016: Q14.B 265.43,160.02 262.89,162.56 R15.2
N$17
  Bottom 1.016: Q15.B 277.11,154.94 266.7,154.94 261.62,160.02 R16.2
N$18
  Bottom 1.016: Q16.B 265.68,151.13 259.33,157.48 R17.2
N$19
  Bottom 1.016: R17.1 DRIVER_IN.1
N$20
  Bottom 1.016: R16.1 DRIVER_IN.2
N$21
  Bottom 1.016: R15.1 DRIVER_IN.3
N$22
  Bottom 1.016: R14.1 DRIVER_IN.4
N$23
  Bottom 1.016: R13.1 DRIVER_IN.5
N$24
  Bottom 1.016: R12.1 DRIVER_IN.6
N$25
  Bottom 1.016: R11.1 DRIVER_IN.7
N$26
  Bottom 1.016: R10.1 DRIVER_IN.8
N$27
  Bottom 1.016: R9.1 DRIVER_IN.9
N$28
  Bottom 1.016: DRIVER_IN.10 R8.1
N$29
  Bottom 1.016: DRIVER_IN.11 R7.1
N$30
  Bottom 1.016: DRIVER_IN.12 R6.1
N$31
  Bottom 1.016: DRIVER_IN.13 R5.1
N$32
  Bottom 1.016: DRIVER_IN.14 R4.1
N$33
  Bottom 1.016: DRIVER_IN.15 R3.1
N$34
  Bottom 1.016: DRIVER_IN.16 R2.1
N$35
  Bottom 1.016: U$1.3 245.1,41.9 247.65,44.45 RELAY_BAR.9
N$36
  Bottom 1.016: U$1.4 247.64,40.63 248.92,41.91 RELAY_BAR.8
N$37
  Bottom 1.016: U$1.5 250.18,38.09 251.46,39.37 RELAY_BAR.7
N$38
  Bottom 1.016: U$1.6 252.72,35.55 254,36.83 RELAY_BAR.6
N$39
  Bottom 1.016: U$1.7 255.26,33.01 256.54,34.29 RELAY_BAR.5
N$40
  Bottom 1.016: U$1.8 257.8,29.2 257.81,29.21 257.81,30.48 259.08,31.75 RELAY_BAR.4
N$41
  Bottom 1.016: U$1.9 260.35,27.94 261.62,29.21 RELAY_BAR.3
N$42
  Bottom 1.016: U$1.10 262.89,25.4 264.16,26.67 RELAY_BAR.2
N$44
  Bottom 1.016: Q17.B 267.97,123.19 259.93,115.15 R1.2
N$45
  Bottom 1.016: Q18.B 269.49,117.09 261.62,109.22 261.62,107.95 260.35,106.68 R18.2
N$46
  Bottom 1.016: Q19.B 267.97,113.03 262.89,107.95 262.89,106.68 260.35,104.14 R19.2
N$47
  Bottom 1.016: Q20.B 265.43,106.43 265.43,105.41 261.62,101.6 R20.2
N$48
  Bottom 1.016: Q21.B 278.38,102.87 266.7,102.87 262.89,99.06 R21.2
N$51
  Bottom 1.016: GROUP_1.2 288.29,210.82 284.48,214.63 281.94,214.63 280.67,213.36 Q1.C
N$52
  Bottom 1.016: Q2.C 270.51,205.74 274.32,205.74 276.86,208.28 GROUP_1.3
N$53
  Bottom 1.016: Q3.C 279.4,204.47 280.67,205.74 GROUP_1.4
N$54
  Bottom 1.016: Q4.C 270.51,198.12 275.59,198.12 276.86,199.39 288.29,199.39 289.56,198.12 GROUP_2.2
N$55
  Bottom 1.016: Q5.C 280.67,196.85 281.94,198.12 284.48,198.12 287.02,195.58 GROUP_2.3
N$56
  Bottom 1.016: Q6.C 270.51,191.77 271.78,193.04 GROUP_2.4
N$57
  Bottom 1.016: GROUP_3.2 281.94,185.42 280.67,186.69 Q7.C
N$58
  Bottom 1.016: GROUP_3.3 276.86,182.88 274.32,180.34 271.78,180.34 270.51,181.61 Q8.C
N$59
  Bottom 1.016: Q9.C 280.67,176.53 287.02,176.53 GROUP_3.4
N$60
  Bottom 1.016: GROUP_4.2 287.02,172.72 285.75,173.99 275.59,173.99 274.32,172.72 271.78,172.72 270.51,173.99 Q10.C
N$61
  Bottom 1.016: GROUP_4.3 289.71,169.06 289.48,169.06 289.33,168.91 281.94,168.91 280.67,170.18 Q11.C
N$62
  Bottom 1.016: Q12.C 270.51,166.37 271.78,165.1 274.32,165.1 275.59,166.37 289.56,166.37 GROUP_4.4
N$63
  Bottom 1.016: Q22.B 264.41,96.52 R22.2
N$64
  Bottom 1.016: Q13.C 280.67,161.29 281.94,160.02 J11.2
N$65
  Bottom 1.016: Q14.C 270.51,157.48 J11.3
N$66
  Bottom 1.016: Q15.C 280.67,152.4 281.94,151.13 287.02,151.13 J11.4
N$67
  Bottom 1.016: Q16.C 270.51,148.59 273.05,146.05 FULL_SPECTRUM.2
N$68
  Bottom 1.016: R23.2 265.68,93.98 266.95,95.25 278.38,95.25 Q23.B
N$69
  Bottom 1.016: R24.2 Q24.B
N$70
  Bottom 1.016: Q25.B 267.97,86.36 265.43,88.9 R25.2
N$71
  Bottom 1.016: Q26.B 266.7,83.82 264.16,86.36 R26.2
N$72
  Bottom 1.016: Q27.B 270.51,77.47 264.16,83.82 R27.2
N$73
  Bottom 1.016: Q28.B 267.97,75.18 267.97,77.47 264.16,81.28 R28.2
N$74
  Bottom 1.016: Q29.B 267.97,69.85 265.43,72.39 265.43,76.2 262.89,78.74 R29.2
N$75
  Bottom 1.016: Q30.B 266.7,66.04 264.16,68.58 264.16,73.66 261.62,76.2 R30.2
N$76
  Bottom 1.016: Q31.B 264.16,60.96 261.62,63.5 261.62,72.39 260.35,73.66 R31.2
N$77
  Bottom 1.016: Q32.B 261.62,55.88 259.93,57.57 R32.2
N$78
  Bottom 1.016: R32.1 DRIVER_IN1.1
N$79
  Bottom 1.016: R31.1 DRIVER_IN1.2
N$80
  Bottom 1.016: DRIVER_IN1.3 R30.1
N$81
  Bottom 1.016: DRIVER_IN1.4 R29.1
N$82
  Bottom 1.016: DRIVER_IN1.5 R28.1
N$83
  Bottom 1.016: DRIVER_IN1.6 R27.1
N$84
  Bottom 1.016: DRIVER_IN1.7 R26.1
N$85
  Bottom 1.016: DRIVER_IN1.8 R25.1
N$86
  Bottom 1.016: DRIVER_IN1.9 R24.1
N$87
  Bottom 1.016: DRIVER_IN1.10 R23.1
N$88
  Bottom 1.016: DRIVER_IN1.11 R22.1
N$89
  Bottom 1.016: DRIVER_IN1.12 R21.1
N$90
  Bottom 1.016: DRIVER_IN1.13 R20.1
N$91
  Bottom 1.016: DRIVER_IN1.14 R19.1
N$92
  Bottom 1.016: DRIVER_IN1.15 R18.1
N$93
  Bottom 1.016: DRIVER_IN1.16 R1.1
N$94
  Bottom 1.016: Q17.C 281.94,120.65 283.21,119.38 GROUP_5.2
N$95
  Bottom 1.016: Q18.C 271.78,116.84 273.05,115.57 275.59,115.57 276.86,116.84 GROUP_5.3
N$96
  Bottom 1.016: GROUP_5.4 288.29,110.49 281.94,110.49 Q19.C
N$97
  Bottom 1.016: Q20.C 270.51,107.95 271.78,106.68 GROUP_6.2
N$98
  Bottom 1.016: Q21.C 281.94,101.6 288.29,101.6 290.83,104.14 GROUP_6.3
N$99
  Bottom 1.016: Q22.C 270.51,97.79 275.59,97.79 275.59,99.06 289.56,99.06 GROUP_6.4
N$100
  Bottom 1.016: Q23.C 281.94,94.13 291.95,94.13 GROUP_7.2
N$101
  Bottom 1.016: Q24.C 270.51,88.9 276.63,88.9 279.17,91.44 GROUP_7.3
N$102
  Bottom 1.016: Q25.C 281.94,83.82 287.02,83.82 GROUP_7.4
N$103
  Bottom 1.016: Q26.C 270.51,81.28 GROUP_8.2
N$104
  Bottom 1.016: GROUP_8.3 290.83,78.74 287.02,74.93 283.21,74.93 281.94,76.2 Q27.C
N$105
  Bottom 1.016: Q28.C 270.51,72.39 288.29,72.39 GROUP_8.4
N$106
  Bottom 1.016: Q29.C 281.94,66.04 284.48,66.04 287.02,68.58 J1.2
N$107
  Bottom 1.016: Q30.C 271.78,63.5 287.02,63.5 289.56,66.04 J1.3
N$108
  Bottom 1.016: Q31.C 281.94,57.15 287.02,57.15 289.56,59.69 289.56,62.23 290.83,63.5 J1.4
N$109
  Bottom 1.016: Q32.C 271.78,53.34 289.56,53.34 FULL_SPECTRUM1.2
N$110  (1 unrouted)
N$111  (1 unrouted)
N$112  (1 unrouted)
N$113  (1 unrouted)
N$114  (1 unrouted)
N$115  (1 unrouted)
N$116  (1 unrouted)
N$117  (1 unrouted)
N$118  (1 unrouted)
N$119  (1 unrouted)
N$120  (1 unrouted)
N$121  (1 unrouted)
N$122  (1 unrouted)
N$123  (1 unrouted)
N$124  (1 unrouted)
N$125  (1 unrouted)
N$126  (1 unrouted)
N$127  (1 unrouted)
N$128  (1 unrouted)
N$129  (1 unrouted)
N$130  (1 unrouted)
N$131  (1 unrouted)
N$132  (1 unrouted)
N$133  (1 unrouted)
N$134  (1 unrouted)
N$135  (1 unrouted)
N$136  (1 unrouted)
N$137  (1 unrouted)
N$138  (1 unrouted)
N$139  (1 unrouted)
N$140  (1 unrouted)
N$141  (1 unrouted)
N$142  (1 unrouted)
N$143  (1 unrouted)
N$144  (1 unrouted)
N$145  (1 unrouted)
N$146  (1 unrouted)
N$147  (1 unrouted)
N$148  (1 unrouted)
N$149  (1 unrouted)
N$150  (1 unrouted)
N$151  (1 unrouted)
N$152  (1 unrouted)
N$153  (1 unrouted)
N$154  (1 unrouted)
N$155  (1 unrouted)
N$156  (1 unrouted)
N$157  (1 unrouted)
N$158  (1 unrouted)
N$159  (1 unrouted)
N$160  (1 unrouted)
N$161  (1 unrouted)
N$162  (1 unrouted)
N$163  (1 unrouted)
N$164  (1 unrouted)
N$165  (1 unrouted)
N$166  (1 unrouted)
N$167  (1 unrouted)
N$168  (1 unrouted)
N$169  (1 unrouted)
N$170  (1 unrouted)
N$171  (1 unrouted)
N$172  (1 unrouted)
N$173  (1 unrouted)
N$174  (1 unrouted)
N$175  (1 unrouted)
N$176  (1 unrouted)
N$177  (1 unrouted)
N$178  (1 unrouted)
N$179  (1 unrouted)
N$180  (1 unrouted)
N$181  (1 unrouted)
N$182  (1 unrouted)
N$183  (1 unrouted)
N$184  (1 unrouted)
N$185  (1 unrouted)
N$186  (1 unrouted)
N$187  (1 unrouted)
N$188  (1 unrouted)
N$189  (1 unrouted)
N$190  (1 unrouted)
N$191  (1 unrouted)
N$192  (1 unrouted)
N$193  (1 unrouted)
N$194  (1 unrouted)
N$195  (1 unrouted)
N$196  (1 unrouted)
N$197  (1 unrouted)
N$198  (1 unrouted)
N$199  (1 unrouted)
N$200  (1 unrouted)
N$201  (1 unrouted)
N$202  (1 unrouted)
N$203  (1 unrouted)
N$204  (1 unrouted)
N$205  (1 unrouted)
N$208
  Bottom 1.016: U$1.11 259.91,16.51 241.96,16.51 237.49,20.98 I2C-PWM1.4 I2C-PWM.4 237.49,146.05 232.41,151.13 214.63,151.13 210.82,147.32 I2C-PWM3.4 I2C-PWM2.4
N$209
  Bottom 1.016: U$1.14 265.3,14.28 241.3,14.28 234.95,20.62 I2C-PWM1.3 I2C-PWM.3 234.95,146.05 232.41,148.59 215.9,148.59 213.36,146.05 I2C-PWM3.3 I2C-PWM2.3
N$210
  Bottom 1.016: 240.03,134.62 I2C-PWM.5 240.03,147.32 233.68,153.67 213.36,153.67 208.28,148.59 I2C-PWM3.5 I2C-PWM2.5 | 240.03,134.62 I2C-PWM1.5 240.03,50.8 | X1.4 240.03,134.62 | U$1.30 240.03,50.8 | RELAY_BAR.10 280.67,46.99 276.86,50.8 240.03,50.8